# EAGLE design smd-to-breadboard (EAGLE 7.6.0)
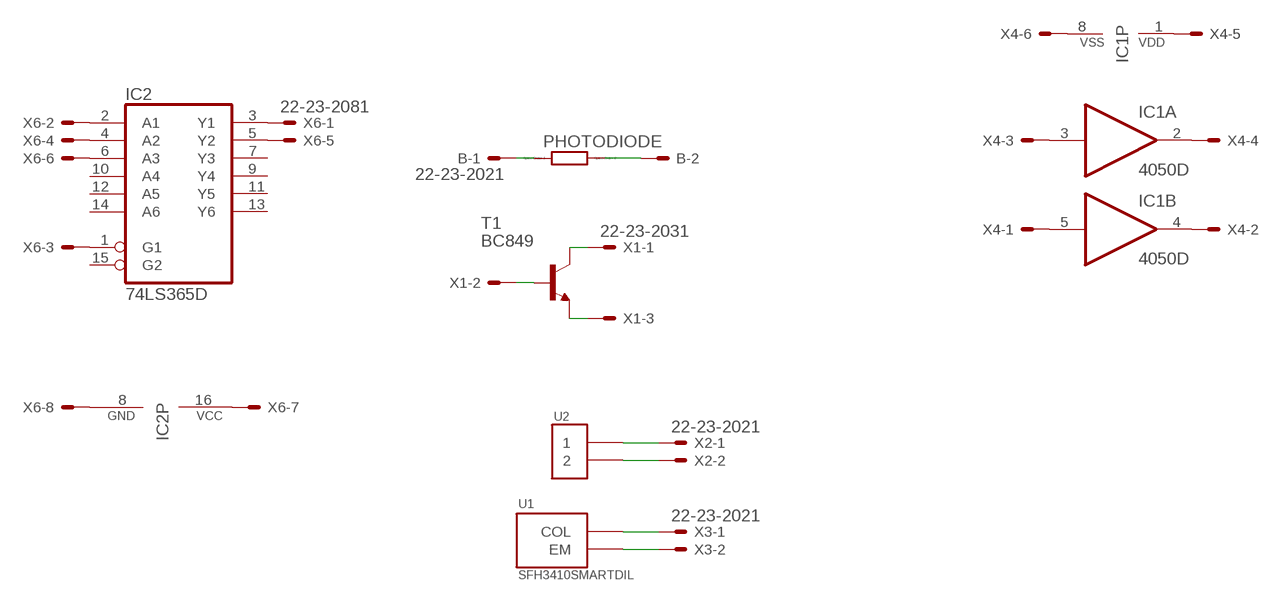
[diagram p0: schematic, sheet 1]

## Parts
B  22-23-2021  [22-23-2021]
IC1  4050D  [SO16]
IC2  74LS365D  [SO16]
PHOTODIODE  RR1206  [R1206]
T1  BC849  [SOT23]
U1  SFH3410SMARTDIL  [SFH3410]
U2  LUW-W5AMGULLWING  [LUW-W5AM]
X1  22-23-2031  [22-23-2031]
X2  22-23-2021  [22-23-2021]
X3  22-23-2021  [22-23-2021]
X4  22-23-2061  [22-23-2061]
X6  22-23-2081  [22-23-2081]

## Nets
N$1: B.1 PHOTODIODE.1
N$2: B.2 PHOTODIODE.2
N$3: T1.3(C) X1.1
N$4: T1.1(B) X1.2
N$5: T1.2(E) X1.3
N$6: U2.1 X2.1
N$7: U2.2 X2.2
N$8: U1.1(COL) X3.1
N$9: U1.2(EM) X3.2
N$10: IC1.5(B:I) X4.1
N$11: IC1.3(A:I) X4.3
N$12: IC1.2(A:O) X4.4
N$13: IC1.4(B:O) X4.2
N$14: IC2.3(Y1) X6.1
N$15: IC2.2(A1) X6.2
N$16: IC2.1(G1) X6.3
N$17: IC2.16(VCC) X6.7
N$18: IC2.8(GND) X6.8
N$19: IC1.8(P:VSS) X4.6
N$20: IC1.1(P:VDD) X4.5
N$21: IC2.4(A2) X6.4
N$22: IC2.5(Y2) X6.5
N$23: IC2.6(A3) X6.6
Unconnected: IC1.6(C:O) IC1.7(C:I) IC1.9(D:I) IC1.10(D:O) IC1.11(E:I) IC1.12(E:O) IC1.14(F:I) IC1.15(F:O) IC2.7(Y3) IC2.9(Y4) IC2.10(A4) IC2.11(Y5) IC2.12(A5) IC2.13(Y6) IC2.14(A6) IC2.15(G2)

## Library data of the parts
B X2 X3 = con-molex:22-23-2021: .100" (2.54mm) Center Header - 2 Pin; MF: MOLEX; MPN: 22-23-2021; OC_FARNELL: 1462926; OC_NEWARK: 25C3832
IC1 = 40xx:4050: Hex non-inverting BUFFER
IC2 = 74xx-us:74*365: Hex BUS DRIVER, 3-state
PHOTODIODE = eagle-ltspice:R: RESISTOR, European symbol; SPICEMODEL: NONE; SPICEPREFIX: R
T1 = transistor:BC849: NPN TRANSISTOR
U1 = licy_extra:SFH3410: Description: SMART DIL Package for SFH3410. Untested dimensions
U2 = licy_extra:LUW-W5AM: Testing package Untested package for power led
X1 = con-molex:22-23-2031: .100" (2.54mm) Center Header - 3 Pin; MF: MOLEX; MPN: 22-23-2031; OC_FARNELL: 1462950; OC_NEWARK: 30C0862
X4 = con-molex:22-23-2061: .100" (2.54mm) Center Header - 6 Pin; MF: MOLEX; MPN: 22-23-2061; OC_FARNELL: 1462922; OC_NEWARK: 27C1933
X6 = con-molex:22-23-2081: .100" (2.54mm) Center Header - 8 Pin; MF: MOLEX; MPN: 22-23-2081; OC_FARNELL: 1756826; OC_NEWARK: 01C7592

## Board
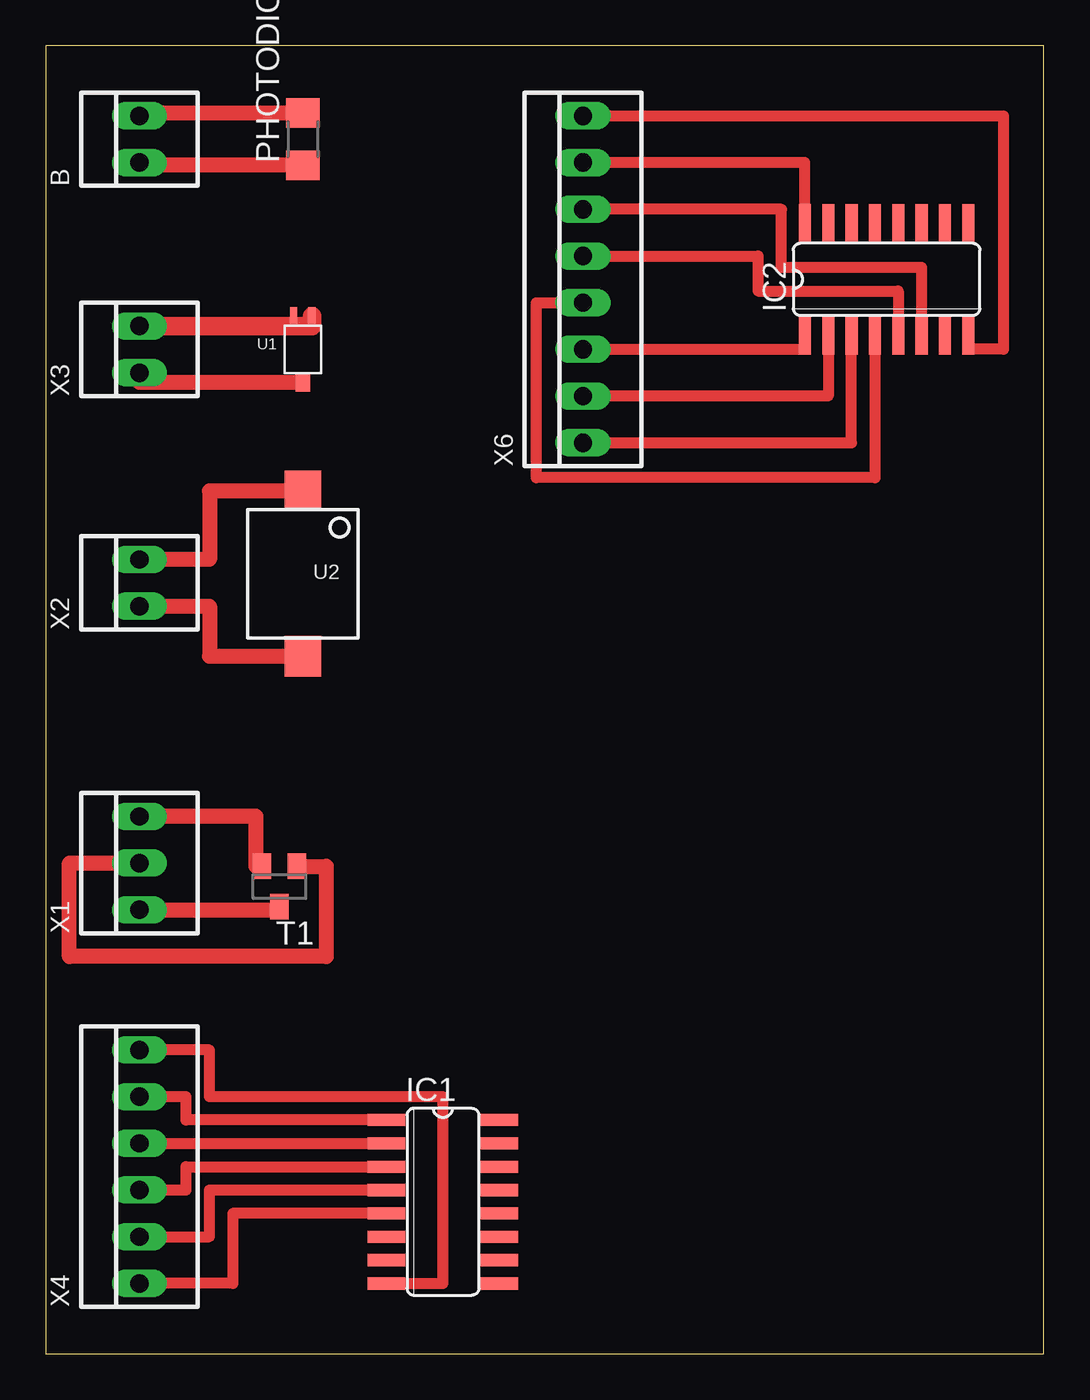
[diagram p1: board, top side]

Size 54.28 x 71.11 mm. Coordinates in mm from the lower left corner, seen from the top.
Outline: 0,0 54.28,0 54.28,71.11 0,71.11 0,0
Copper layers (1*16): Top 0.035mm / dielectric 1.5mm / Bottom 0.035mm
Design rules "default": minimum track width 10mil, minimum drill 24mil, track to track 8mil, track to pad 8mil, pad to pad 8mil, via to via 8mil, smd to smd 8mil, copper to edge 40mil, drill to drill 8mil, minimum pad ring 10mil, minimum via ring 8mil, stop-mask expansion 4mil, vias tented up to drill 0mil, thermal gap 10mil

### Footprints (pad centres in the part's own frame; a part is rotated, then mirrored left to right if it is on the bottom)
22-23-2021 = drill 1 long: 1 -1.27,0; 2 1.27,0
SO16 = smd 0.66 x 2.032: 1 -4.445,-3.073; 2 -3.175,-3.073; 3 -1.905,-3.073; 4 -0.635,-3.073; 5 0.635,-3.073; 6 1.905,-3.073; 7 3.175,-3.073; 8 4.445,-3.073; 9 4.445,3.073; 10 3.175,3.073; 11 1.905,3.073; 12 0.635,3.073; 13 -0.635,3.073; 14 -1.905,3.073; 15 -3.175,3.073; 16 -4.445,3.073
R1206 = smd 1.6 x 1.803: 1 -1.422,0; 2 1.422,0
SOT23 = smd 1 x 1.4: 1 -0.95,-1.1; 2 0.95,-1.1; 3 0,1.1
SFH3410 = smd 0.8 x 1: 1 0,1.8 | smd 0.4 x 1: 2 -0.5,-1.8; 3 0.5,-1.8
LUW-W5AM = smd 2 x 2.2: 1 0,4; 2 0,-5
22-23-2031 = drill 1 long: 1 -2.54,0; 2 0,0; 3 2.54,0
22-23-2061 = drill 1 long: 1 -6.35,0; 2 -3.81,0; 3 -1.27,0; 4 1.27,0; 5 3.81,0; 6 6.35,0
22-23-2081 = drill 1 long: 1 -8.89,0; 2 -6.35,0; 3 -3.81,0; 4 -1.27,0; 5 1.27,0; 6 3.81,0; 7 6.35,0; 8 8.89,0

### Placement (x,y rotation side)
B  5.08,66.04 90 top
IC1  21.59,8.25 270 top
IC2  45.72,58.42 0 top
PHOTODIODE  13.97,66.04 90 top
T1  12.7,25.4 180 top
U1  13.97,54.61 180 top
U2  13.97,41.91 180 top
X1  5.08,26.67 90 top
X2  5.08,41.91 90 top
X3  5.08,54.61 90 top
X4  5.08,10.16 90 top
X6  29.21,58.42 90 top

### Tracks (layer width: path | path; a pad name or v marks a point on that pad's centre or on a via)
N$1
  Top 0.813: PHOTODIODE.1 5.08,64.62 B.1
N$2
  Top 0.813: PHOTODIODE.2 5.08,67.46 B.2
N$3
  Top 0.813: X1.1 12.7,24.13 T1.3
N$4
  Top 0.813: T1.1 15.24,26.5 15.24,21.59 1.27,21.59 1.27,26.67 X1.2
N$5
  Top 0.813: T1.2 11.43,26.5 11.43,29.21 X1.3
N$6
  Top 0.813: X2.1 8.89,40.64 8.89,37.91 U2.1
N$7
  Top 0.813: U2.2 8.89,46.91 8.89,43.18 X2.2
N$8
  Top 0.813: U1.1 5.08,52.81 X3.1
N$9
  Top 1.016: X3.2 14.47,55.88 U1.2
N$10
  Top 0.61: IC1.5 10.16,7.62 10.16,3.81 X4.1
N$11
  Top 0.61: X4.3 7.62,8.89 7.62,10.16 IC1.3
N$12
  Top 0.61: X4.4 IC1.2
N$13
  Top 0.61: X4.2 8.89,6.35 8.89,8.89 IC1.4
N$14
  Top 0.61: X6.1 43.81,49.53 IC2.3 43.81,55.88
N$15
  Top 0.61: IC2.2 42.55,52.07 X6.2
N$16
  Top 0.61: X6.3 41.27,54.61 IC2.1
N$17
  Top 0.61: IC2.16 41.27,64.77 X6.7
N$18
  Top 0.61: X6.8 52.07,67.31 52.07,54.61 50.16,54.61 IC2.8
N$19
  Top 0.61: IC1.8 21.59,3.81 21.59,13.97 8.89,13.97 8.89,16.51 X4.6
N$20
  Top 0.61: IC1.1 7.62,12.7 7.62,13.97 X4.5
N$21
  Top 0.61: IC2.4 45.09,47.62 26.67,47.62 26.67,57.15 X6.4
N$22
  Top 0.61: X6.5 38.73,59.69 38.73,57.78 46.35,57.78 IC2.5
N$23
  Top 0.61: IC2.6 47.62,59.05 40.01,59.05 40.01,62.23 X6.6